# Altium schematic sheet Encode Schematic.SchDoc
size A4; SheetNumber: 1; SheetTotal: 6
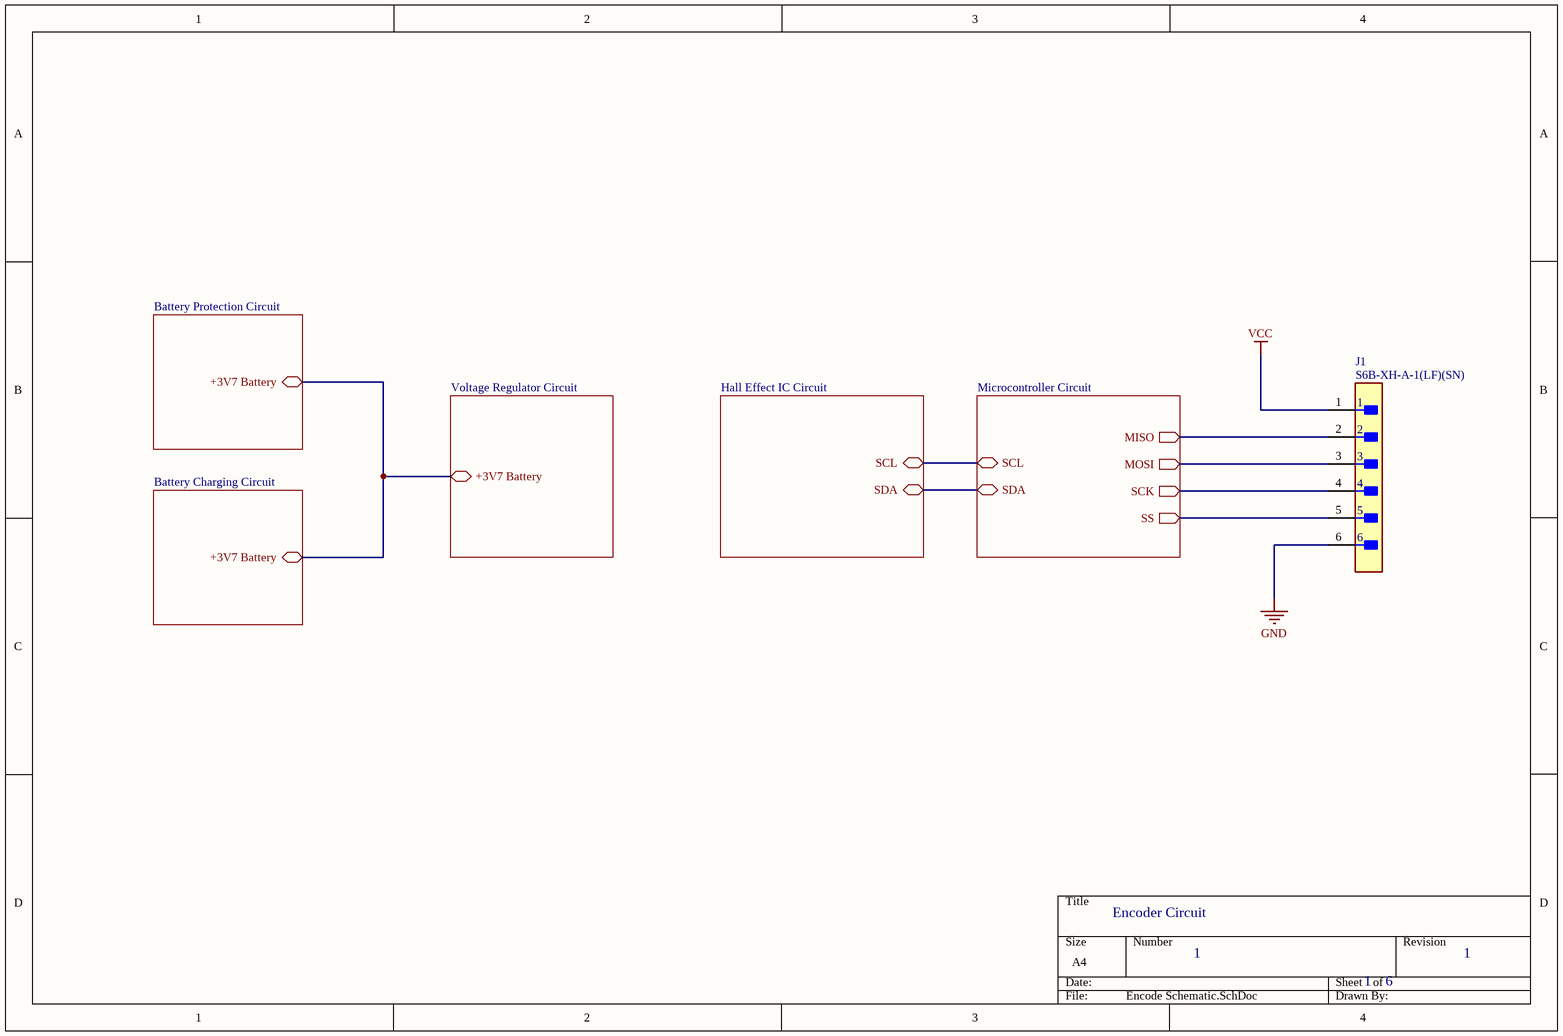
[diagram p0: Encode Schematic.SchDoc]

## Parts
J1  S6B-XH-A-1(LF)(SN)  [FP-S6B-XH-A-1_LF_SN-MFG]

## Sub-sheets
Battery Charging Circuit = Battery Charger.SchDoc: +3V7 Battery (bidir)
Battery Protection Circuit = Battery Protection.SchDoc: +3V7 Battery (bidir)
Hall Effect IC Circuit = Hall Effect IC.SchDoc: SCL (bidir), SDA (bidir)
Microcontroller Circuit = Microcontroller.SchDoc: MOSI (out), MISO (out), SCK (out), SS (out), SCL (bidir), SDA (bidir)
Voltage Regulator Circuit = Voltage Regulator.SchDoc: +3V7 Battery (bidir)

## Nets
GND: J1.6
VCC: J1.1
NetJ1_2: J1.2 ; sheet Microcontroller Circuit/MISO
NetJ1_3: J1.3 ; sheet Microcontroller Circuit/MOSI
NetJ1_4: J1.4 ; sheet Microcontroller Circuit/SCK
NetJ1_5: J1.5 ; sheet Microcontroller Circuit/SS
(unnamed): sheet Microcontroller Circuit/SCL, sheet Hall Effect IC Circuit/SCL
(unnamed): sheet Microcontroller Circuit/SDA, sheet Hall Effect IC Circuit/SDA
(unnamed): sheet Battery Charging Circuit/+3V7 Battery, sheet Battery Protection Circuit/+3V7 Battery, sheet Voltage Regulator Circuit/+3V7 Battery

## Notes on the sheet
- Encoder Circuit
- 1
- 6

## Library data of the parts
J1 = CMP-17439-000023-1: CONN HEADER R/A P6OS 2.5MM; Voltage Rating: 250V; Insulation Resistance: 1GR; Current Rating: 3A; Number of Positions: 6; Gender: Male; Mount: Through Hole; Material: Polyamide; Max Operating Temperature: 85°C; Contact Plating: Tin; Number of Rows: 1; Color: Natural; Termination: Crimp; Min Operating Temperature: -25°C; Pitch: 2.5mm; Lead Free: Lead Free; Contact Material: Brass